# Altium project Adapter_NI_IP_L0.PrjPCB
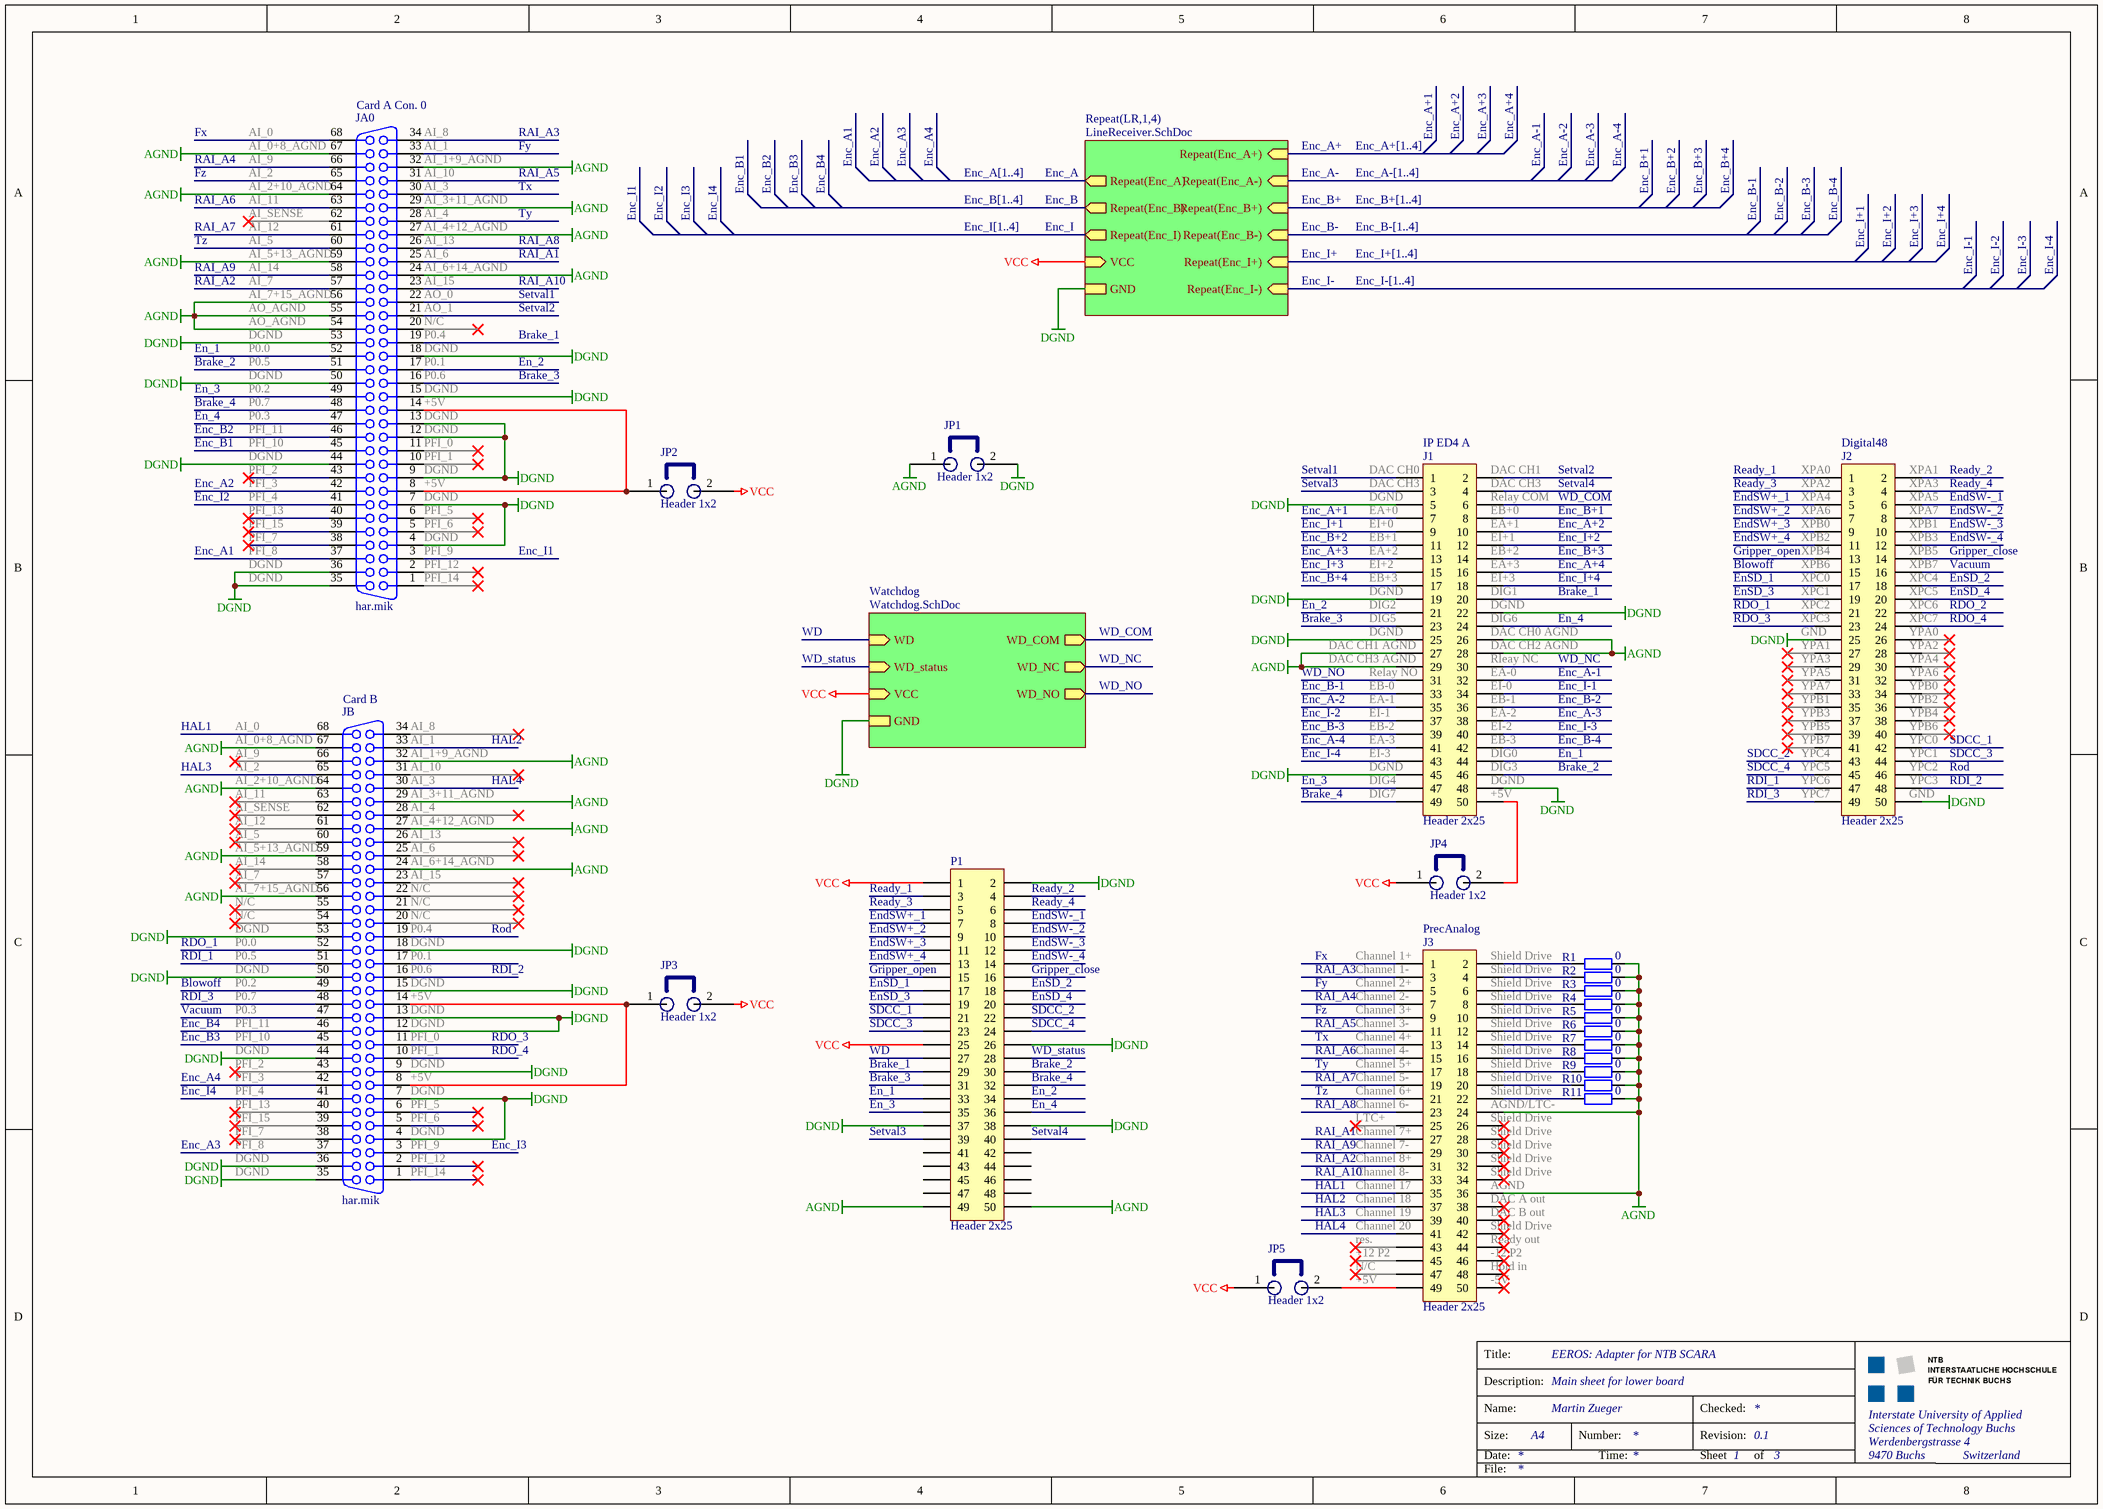
[diagram p0: Schematic_L0.SchDoc]
3 sheets, 80 parts. Net scope: hierarchical (ports join the sheet entries above them; power ports are global).
Board file: PCB_L0.PcbDoc
Sheets:
  Schematic_L0.SchDoc
    LR1 = LineReceiver.SchDoc
    LR2 = LineReceiver.SchDoc
    LR3 = LineReceiver.SchDoc
    LR4 = LineReceiver.SchDoc
    Watchdog = Watchdog.SchDoc

## Sheet Schematic_L0.SchDoc: EEROS: Adapter for NTB SCARA
size A3; Author: Martin Zueger; CompanyName: Company Name; Organization: Interstate University of Applied; Address1: Werdenbergstrasse 4; Address3: 9470 Buchs; Address4: Switzerland; Revision: 0.1; SheetNumber: 1; SheetTotal: 3; Organization1: Sciences of Technology Buchs; Description: Main sheet for lower board; ProjectName: EEROS

### Parts
J1  Header 2x25  [Header - 2x25 - Boxed]
J2  Header 2x25  [Header - 2x25 - Boxed]
J3  Header 2x25  [Header - 2x25 - Boxed]
JA0  har.mik  [HAR-MIK P/S 68 SA]
JB  har.mik  [HAR-MIK P/S 68 SA]
JP1  Header 1x2  [Header - 1x2 - V]
JP2  Header 1x2  [Header - 1x2 - V]
JP3  Header 1x2  [Header - 1x2 - V]
JP4  Header 1x2  [Header - 1x2 - V]
JP5  Header 1x2  [Header - 1x2 - V]
P1  Header 2x25  [Header - 2x25 - V]
R1  0  [0805]
R2  0  [0805]
R3  0  [0805]
R4  0  [0805]
R5  0  [0805]
R6  0  [0805]
R7  0  [0805]
R8  0  [0805]
R9  0  [0805]
R10  0  [0805]
R11  0  [0805]

### Sub-sheets
Repeat(LR,1,4) = LineReceiver.SchDoc: Repeat(Enc_A), Repeat(Enc_B), Repeat(Enc_I), Repeat(Enc_A+) (in), Repeat(Enc_B+), Repeat(Enc_B-), Repeat(Enc_I+), Repeat(Enc_I-), Repeat(Enc_A-), VCC, GND
Watchdog = Watchdog.SchDoc: WD_COM, WD_NC, WD_NO, WD, VCC, GND, WD_status

### Nets
AGND: J1.26 J1.27 J1.28 J1.29 J3.24 J3.36 JA0.24 JA0.27 JA0.29 JA0.32 JA0.54 JA0.55 JA0.56 JA0.59 JA0.64 JA0.67 JB.24 JB.27 JB.29 JB.32 JB.56 JB.59 JB.64 JB.67 JP1.1 P1.49 P1.50 R1.2 R2.2 R3.2 R4.2 R5.2 R6.2 R7.2 R8.2 R9.2 R10.2 R11.2
DGND: J1.5 J1.19 J1.22 J1.25 J1.45 J1.48 J2.25 J2.50 JA0.4 JA0.7 JA0.9 JA0.12 JA0.13 JA0.15 JA0.18 JA0.35 JA0.36 JA0.44 JA0.50 JA0.53 JB.4 JB.7 JB.9 JB.12 JB.13 JB.15 JB.18 JB.35 JB.36 JB.44 JB.50 JB.53 JP1.2 P1.2 P1.26 P1.37 P1.38 ; sheet Repeat(LR,1,4)/GND, sheet Watchdog/GND
VCC: JP2.2 JP3.2 JP4.1 JP5.1 P1.1 P1.25 ; sheet Repeat(LR,1,4)/VCC, sheet Watchdog/VCC
Blowoff: J2.15 JB.49
Brake_1: J1.20 JA0.19 P1.29
Brake_2: J1.46 JA0.51 P1.30
Brake_3: J1.23 JA0.16 P1.31
Brake_4: J1.49 JA0.48 P1.32
En_1: J1.44 JA0.52 P1.33
En_2: J1.21 JA0.17 P1.34
En_3: J1.47 JA0.49 P1.35
En_4: J1.24 JA0.47 P1.36
Enc_A: sheet Repeat(LR,1,4)/Repeat(Enc_A)
Enc_A1: JA0.37
Enc_A2: JA0.42
Enc_A3: JB.37
Enc_A4: JB.42
Enc_A+: sheet Repeat(LR,1,4)/Repeat(Enc_A+)
Enc_A+1: J1.7
Enc_A+2: J1.10
Enc_A+3: J1.13
Enc_A+4: J1.16
Enc_A-: sheet Repeat(LR,1,4)/Repeat(Enc_A-)
Enc_A-1: J1.32
Enc_A-2: J1.35
Enc_A-3: J1.38
Enc_A-4: J1.41
Enc_B: sheet Repeat(LR,1,4)/Repeat(Enc_B)
Enc_B1: JA0.45
Enc_B2: JA0.46
Enc_B3: JB.45
Enc_B4: JB.46
Enc_B+: sheet Repeat(LR,1,4)/Repeat(Enc_B+)
Enc_B+1: J1.8
Enc_B+2: J1.11
Enc_B+3: J1.14
Enc_B+4: J1.17
Enc_B-: sheet Repeat(LR,1,4)/Repeat(Enc_B-)
Enc_B-1: J1.33
Enc_B-2: J1.36
Enc_B-3: J1.39
Enc_B-4: J1.42
Enc_I: sheet Repeat(LR,1,4)/Repeat(Enc_I)
Enc_I1: JA0.3
Enc_I2: JA0.41
Enc_I3: JB.3
Enc_I4: JB.41
Enc_I+: sheet Repeat(LR,1,4)/Repeat(Enc_I+)
Enc_I+1: J1.9
Enc_I+2: J1.12
Enc_I+3: J1.15
Enc_I+4: J1.18
Enc_I-: sheet Repeat(LR,1,4)/Repeat(Enc_I-)
Enc_I-1: J1.34
Enc_I-2: J1.37
Enc_I-3: J1.40
Enc_I-4: J1.43
EndSW+_1: J2.5 P1.7
EndSW+_2: J2.7 P1.9
EndSW+_3: J2.9 P1.11
EndSW+_4: J2.11 P1.13
EndSW-_1: J2.6 P1.8
EndSW-_2: J2.8 P1.10
EndSW-_3: J2.10 P1.12
EndSW-_4: J2.12 P1.14
EnSD_1: J2.17 P1.17
EnSD_2: J2.18 P1.18
EnSD_3: J2.19 P1.19
EnSD_4: J2.20 P1.20
Fx: J3.1 JA0.68
Fy: J3.5 JA0.33
Fz: J3.9 JA0.65
Gripper_close: J2.14 P1.16
Gripper_open: J2.13 P1.15
HAL1: J3.35 JB.68
HAL2: J3.37 JB.33
HAL3: J3.39 JB.65
HAL4: J3.41 JB.30
RAI_A1: J3.27 JA0.25
RAI_A2: J3.31 JA0.57
RAI_A3: J3.3 JA0.34
RAI_A4: J3.7 JA0.66
RAI_A5: J3.11 JA0.31
RAI_A6: J3.15 JA0.63
RAI_A7: J3.19 JA0.61
RAI_A8: J3.23 JA0.26
RAI_A9: J3.29 JA0.58
RAI_A10: J3.33 JA0.23
RDI_1: J2.47 JB.51
RDI_2: J2.48 JB.16
RDI_3: J2.49 JB.48
RDO_1: J2.21 JB.52
RDO_2: J2.22
RDO_3: J2.23 JB.11
RDO_4: J2.24 JB.10
Ready_1: J2.1 P1.3
Ready_2: J2.2 P1.4
Ready_3: J2.3 P1.5
Ready_4: J2.4 P1.6
Rod: J2.46 JB.19
SDCC_1: J2.42 P1.21
SDCC_2: J2.43 P1.22
SDCC_3: J2.44 P1.23
SDCC_4: J2.45 P1.24
Setval1: J1.1 JA0.22
Setval2: J1.2 JA0.21
Setval3: J1.3 P1.39
Setval4: J1.4 P1.40
Tx: J3.13 JA0.30
Ty: J3.17 JA0.28
Tz: J3.21 JA0.60
Vacuum: J2.16 JB.47
WD: P1.27 ; sheet Watchdog/WD
WD_COM: J1.6 ; sheet Watchdog/WD_COM
WD_NC: J1.30 ; sheet Watchdog/WD_NC
WD_NO: J1.31 ; sheet Watchdog/WD_NO
WD_status: P1.28 ; sheet Watchdog/WD_status
NetJ1_50: J1.50 JP4.2
NetJ3_2: J3.2 R1.1
NetJ3_4: J3.4 R2.1
NetJ3_6: J3.6 R3.1
NetJ3_8: J3.8 R4.1
NetJ3_10: J3.10 R5.1
NetJ3_12: J3.12 R6.1
NetJ3_14: J3.14 R7.1
NetJ3_16: J3.16 R8.1
NetJ3_18: J3.18 R9.1
NetJ3_20: J3.20 R10.1
NetJ3_22: J3.22 R11.1
NetJ3_49: J3.49 JP5.2
NetJA0_8: JA0.8 JA0.14 JP2.1
NetJB_8: JB.8 JB.14 JP3.1

Not connected (* = marked no-connect by the designer): J2 26* 27* 28* 29* 30* 31* 32* 33* 34* 35* 36* 37* 38* 39* 40* 41*; J3 25* 26* 28* 30* 32* 34* 38* 40* 42* 43* 44* 45* 46* 47* 48* 50*; JA0 1* 2* 5* 6* 10* 11* 20* 38* 39* 40* 43* 62*; JB 1* 2* 5* 6* 17 20* 21* 22* 23* 25* 26* 28* 31* 34* 38* 39* 40* 43* 54* 55* 57* 58* 60* 61* 62* 63* 66*; P1 41 42 43 44 45 46 47 48

### Buses and harness runs
bus Enc_A+[1..4]
bus Enc_A-[1..4]
bus Enc_A[1..4]
bus Enc_B+[1..4]
bus Enc_B-[1..4]
bus Enc_B[1..4]
bus Enc_I+[1..4]
bus Enc_I-[1..4]
bus Enc_I[1..4]

### Notes on the sheet
- (near JA0) Card A Con. 0
- AI_0
- AI_9
- AI_2
- (near JA0) AI_0+8_AGND
- (near JA0) AI_8
- (near JA0) AI_1
- (near JA0) AI_1+9_AGND
- (near JA0) AI_10
- AI_11
- AI_SENSE
- AI_12
- AI_5
- (near JA0) AI_2+10_AGND
- (near JA0) AI_3
- (near JA0) AI_3+11_AGND
- (near JA0) AI_4
- (near JA0) AI_4+12_AGND
- (near JA0) AI_13
- AI_14
- AI_7
- AO_AGND
- (near JA0) AI_7+15_AGND
- (near JA0) AI_5+13_AGND
- (near JA0) AI_6
- (near JA0) AI_6+14_AGND
- (near JA0) AI_15
- (near JA0) AO_0
- (near JA0) AO_1
- P0.0
- P0.5
- DGND
- (near JA0) N/C
- (near JA0) P0.4
- (near JA0) DGND
- (near JA0) P0.1
- (near JA0) P0.6
- P0.2
- P0.7
- P0.3
- PFI_11
- PFI_10
- (near JA0) +5V
- (near JA0) PFI_0
- (near J1) IP ED4 A
- (near J2) Digital48
- PFI_2
- PFI_3
- PFI_4
- PFI_13
- (near JA0) PFI_1
- (near JA0) PFI_5
- (near J1) DAC CH0
- (near J1) DAC CH3
- (near J1) DGND
- (near J1) EA+0
- (near J1) DAC CH1
- (near J1) Relay COM
- (near J1) EB+0
- (near J2) XPA0
- (near J2) XPA2
- (near J2) XPA4
- (near J2) XPA6
- (near J2) XPA1
- (near J2) XPA3
- (near J2) XPA5
- (near J2) XPA7
- PFI_15
- PFI_7
- PFI_8
- (near JA0) PFI_6
- (near JA0) PFI_9
- (near JA0) PFI_12
- (near JA0) PFI_14
- (near J1) EB+3
- (near J1) EI+2
- (near J1) EA+2
- (near J1) EB+1
- (near J1) EI+0
- (near J1) EA+1
- (near J1) EI+1
- (near J1) EB+2
- (near J1) EA+3
- (near J1) EI+3
- (near J2) XPB0
- (near J2) XPB2
- (near J2) XPB4
- (near J2) XPB6
- (near J2) XPC0
- (near J2) XPB1
- (near J2) XPB3
- (near J2) XPB5
- (near J2) XPB7
- (near J2) XPC4
- (near J1) DAC CH1 AGND
- (near J1) DIG5
- (near J1) DIG2
- (near J1) DAC CH0 AGND
- (near J1) DAC CH2 AGND
- (near J1) DIG1
- (near J1) DIG6
- (near J2) XPC1
- (near J2) XPC2
- (near J2) XPC3
- (near J2) GND
- (near J2) YPA1
- (near J2) XPC5
- (near J2) XPC6
- (near J2) XPC7
- (near J2) YPA0
- (near J2) YPA2
- (near JB) Card B
- (near J1) DAC CH3 AGND
- (near J1) Relay NO
- (near J1) EI-1
- (near J1) EA-1
- (near J1) EB-0
- (near J1) Rleay NC
- (near J1) EA-0
- (near J1) EI-0
- (near J1) EB-1
- (near J1) EA-2
- (near J2) YPA3
- (near J2) YPA5
- (near J2) YPA7
- (near J2) YPB1
- (near J2) YPB3
- (near J2) YPA4
- (near J2) YPA6
- (near J2) YPB0
- (near J2) YPB2
- (near J2) YPB4
- (near JB) AI_2+10_AGND
- (near JB) AI_0+8_AGND
- (near JB) AI_8
- (near JB) AI_1
- (near JB) AI_1+9_AGND
- (near JB) AI_10
- (near JB) AI_3
- (near J1) DIG4
- (near J1) EI-3
- (near J1) EA-3
- (near J1) EB-2
- (near J1) EI-2
- (near J1) EB-3
- (near J1) DIG0
- (near J1) DIG3
- (near J2) YPB5
- (near J2) YPB7
- (near J2) YPC4
- (near J2) YPC5
- (near J2) YPC6
- (near J2) YPB6
- (near J2) YPC0
- (near J2) YPC1
- (near J2) YPC2
- (near J2) YPC3
- (near JB) AI_5+13_AGND
- (near JB) AI_3+11_AGND
- (near JB) AI_4
- (near JB) AI_4+12_AGND
- (near JB) AI_13
- (near JB) AI_6
- (near J1) DIG7
- (near J1) +5V
- (near J2) YPC7
- (near JB) AI_7+15_AGND
- N/C
- (near JB) N/C
- (near JB) AI_6+14_AGND
- (near JB) AI_15
- (near JB) P0.4
- (near JB) DGND
- (near JB) P0.1
- (near JB) P0.6
- (near J3) Channel 1+
- (near J3) Channel 1-
- (near J3) Channel 2+
- PrecAnalog
- Shield Drive
- (near JB) +5V
- (near JB) PFI_0
- (near JB) PFI_1
- (near J3) Channel 2-
- (near J3) Channel 3+
- (near J3) Channel 3-
- (near J3) Channel 4+
- (near J3) Channel 4-
- (near JB) PFI_5
- (near JB) PFI_6
- (near J3) Channel 5+
- (near J3) Channel 5-
- (near J3) Channel 6+
- (near J3) Channel 6-
- (near J3) LTC+
- (near J3) AGND/LTC-
- (near J3) Shield Drive
- (near JB) PFI_9
- (near JB) PFI_12
- (near JB) PFI_14
- (near J3) Channel 7+
- (near J3) Channel 7-
- (near J3) Channel 8+
- (near J3) Channel 8-
- (near J3) Channel 17
- (near J3) AGND
- (near J3) Channel 18
- (near J3) Channel 19
- (near J3) Channel 20
- res.
- (near J3) +12 P2
- (near J3) DAC A out
- (near J3) DAC B out
- (near J3) Ready out
- (near J3) -12 P2
- +5V
- (near J3) Hold in
- (near J3) -5V
- Title:
- Description:
- Size:
- Date:
- Name:
- A4
- Number:
- Time:
- Revision:
- Sheet
- Checked:
- of
- File:

### Library data of the parts
J1-J3 P1 = Header 2x25: Header, 25-Pin, Dual row; LatestRevisionDate: 17-Jul-2002; LatestRevisionNote: Re-released for DXP Platform.; Publisher: Altium Limited
JA0 JB = Connector 68: TB 60 01 068 5232; PackageDocument: B; Positions: 68; Published: 15-Jun-2001; LatestRevisionDate: 17-Jul-2002; LatestRevisionNote: Re-released for DXP Platform.; DatasheetDocument: 1-Oct-1983; PackageReference: 178240-8; Publisher: Altium Limited; Orientation: Right Angle
JP1-JP5 = Jumper
R1-R11 = R: Resistor; #Manufacturer: Generic Components; #Publisher: Dr. A. Heinzelmann; #Class: Passive; #Published: 2006-10-06; #ClassSub: Resistor; Value: 0

## Sheet LineReceiver.SchDoc: EEROS: Adapter for NTB SCARA
size A4; Author: URSS; CompanyName: NTB; DrawnBy: Martin Zueger; Organization: NTB Interstate University of Applied; Address1: Werdenbergstrasse 4; Address3: 9471 Buchs; Address4: Switzerland; Revision: 0.1; SheetNumber: 2; SheetTotal: 3; Organization1: Sciences of Technology Buchs; Description: Line Receiver A,B and I with SN75175D; ProjectName: EEROS
Used 4 times, as channels LR1, LR2, LR3, LR4. Parts and nets are listed once, with the designators drawn on the sheet.
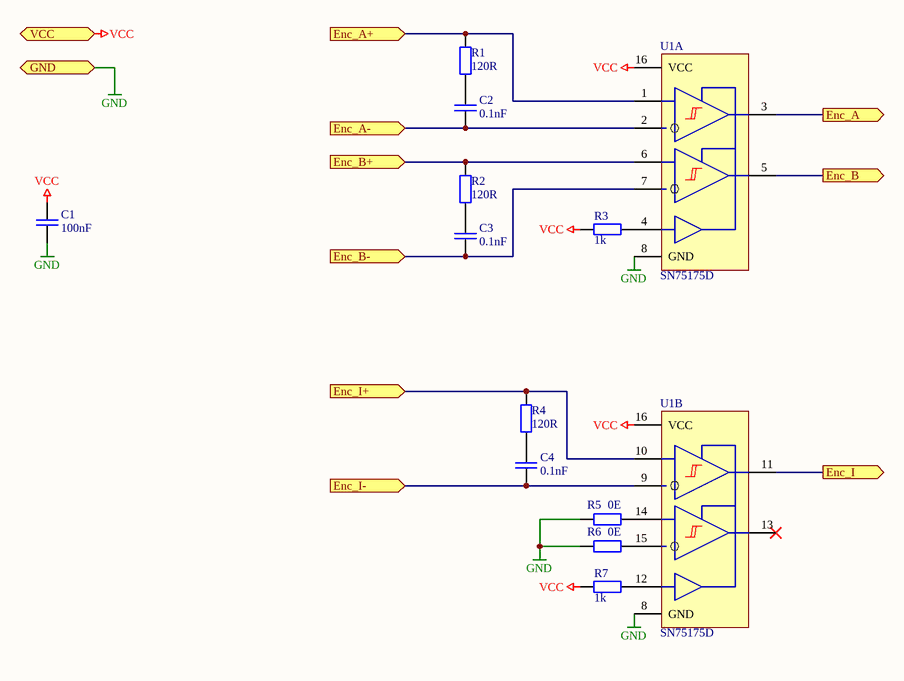
[diagram p1: LineReceiver.SchDoc]

### Parts
C1  100nF  [1206]
C2  0.1nF  [0805]
C3  0.1nF  [0805]
C4  0.1nF  [0805]
R1  120R  [0805]
R2  120R  [0805]
R3  1k  [0805]
R4  120R  [0805]
R5  0E  [0805]
R6  0E  [0805]
R7  1k  [0805]
U1  SN75175D  [SO16-M]  (parts A,B of 2)

### Ports
Enc_A (out), Enc_A+ (in), Enc_A- (in), Enc_B (out), Enc_B+ (in), Enc_B- (in), Enc_I (out), Enc_I+ (in), Enc_I- (in), GND, VCC (in)

### Nets
GND: C1.1 R5.2 R6.2 U1.8(GND) ; port GND
VCC: C1.2 R3.2 R7.2 U1.16(VCC) ; port VCC
Enc_A: U1.3 ; port Enc_A
Enc_A+: R1.2 U1.1 ; port Enc_A+
Enc_A-: C2.1 U1.2 ; port Enc_A-
Enc_B: U1.5 ; port Enc_B
Enc_B+: R2.2 U1.6 ; port Enc_B+
Enc_B-: C3.1 U1.7 ; port Enc_B-
Enc_I: U1.11 ; port Enc_I
Enc_I+: R4.2 U1.10 ; port Enc_I+
Enc_I-: C4.1 U1.9 ; port Enc_I-
NetC2_2: C2.2 R1.1
NetC3_2: C3.2 R2.1
NetC4_2: C4.2 R4.1
NetR3_1: R3.1 U1.4(EN)
NetR5_1: R5.1 U1.14
NetR6_1: R6.1 U1.15
NetR7_1: R7.1 U1.12

Not connected (* = marked no-connect by the designer): U1 13*

### Channels
LR1: designators end in _LR1; ports Enc_A+=Enc_A+1 Enc_A-=Enc_A-1 Enc_A=Enc_A1 Enc_B+=Enc_B+1 Enc_B-=Enc_B-1 Enc_B=Enc_B1 Enc_I+=Enc_I+1 Enc_I-=Enc_I-1 Enc_I=Enc_I1 GND=DGND VCC=VCC
LR2: designators end in _LR2; ports Enc_A+=Enc_A+2 Enc_A-=Enc_A-2 Enc_A=Enc_A2 Enc_B+=Enc_B+2 Enc_B-=Enc_B-2 Enc_B=Enc_B2 Enc_I+=Enc_I+2 Enc_I-=Enc_I-2 Enc_I=Enc_I2 GND=DGND VCC=VCC
LR3: designators end in _LR3; ports Enc_A+=Enc_A+3 Enc_A-=Enc_A-3 Enc_A=Enc_A3 Enc_B+=Enc_B+3 Enc_B-=Enc_B-3 Enc_B=Enc_B3 Enc_I+=Enc_I+3 Enc_I-=Enc_I-3 Enc_I=Enc_I3 GND=DGND VCC=VCC
LR4: designators end in _LR4; ports Enc_A+=Enc_A+4 Enc_A-=Enc_A-4 Enc_A=Enc_A4 Enc_B+=Enc_B+4 Enc_B-=Enc_B-4 Enc_B=Enc_B4 Enc_I+=Enc_I+4 Enc_I-=Enc_I-4 Enc_I=Enc_I4 GND=DGND VCC=VCC

### Notes on the sheet
- Title:
- Description:
- Size:
- Date:
- Name:
- A4
- Number:
- Time:
- Revision:
- Sheet
- Checked:
- of
- File:

### Library data of the parts
C1-C4 = C: Capacitor; #Manufacturer: Generic Components; #Publisher: Dr. A. Heinzelmann; #Class: Passive; Initial Voltage: 0V; Voltage Maximum: ??? V; #Published: 2006-10-07; #ClassSub: Capacitor
  C1: Value: 100nF
  C2-C4: Value: 0.1nF
R1-R7 = R: as R1 on sheet Schematic_L0; #Published: 2006-10-06; #ClassSub: Resistor
  R1 R2 R4: Value: 120R
  R3 R7: Value: 1k
  R5 R6: Value: 0E
U1 = SN75175D: TEXAS INSTRUMENTS - SN75175D - LINE RECEIVER,QUAD RS485/422/423; #Manufacturer: TI; #Class: Interface; OrderNr: 1103177; Published: 20121204; LatestRevisionDate: 20121204; LatestRevisionNote: create symbol and footprint; PackageReference: TI--R-PDSO-G16--SOIC16; Publisher: Stefan Ursella, M.Eng; #ClassSub: line receiver; ComponentLink1Description: Distributor; ComponentLink1URL: http://ch.farnell.com/texas-instruments/sn75175d/line-receiver-quad-rs485-422-423/dp/1103177; Distributor: Farnell; PackageDescription: SOIC16; Type: SN75175D

## Sheet Watchdog.SchDoc: EEROS: Adapter for NTB SCARA
size A4; DrawnBy: Martin Zueger; Organization: Interstate University of Applied; Address1: Werdenbergstrasse 4; Address3: 9470 Buchs; Address4: Switzerland; Revision: 0.1; SheetNumber: 3; SheetTotal: 3; Organization1: Sciences of Technology Buchs; ProjectName: EEROS
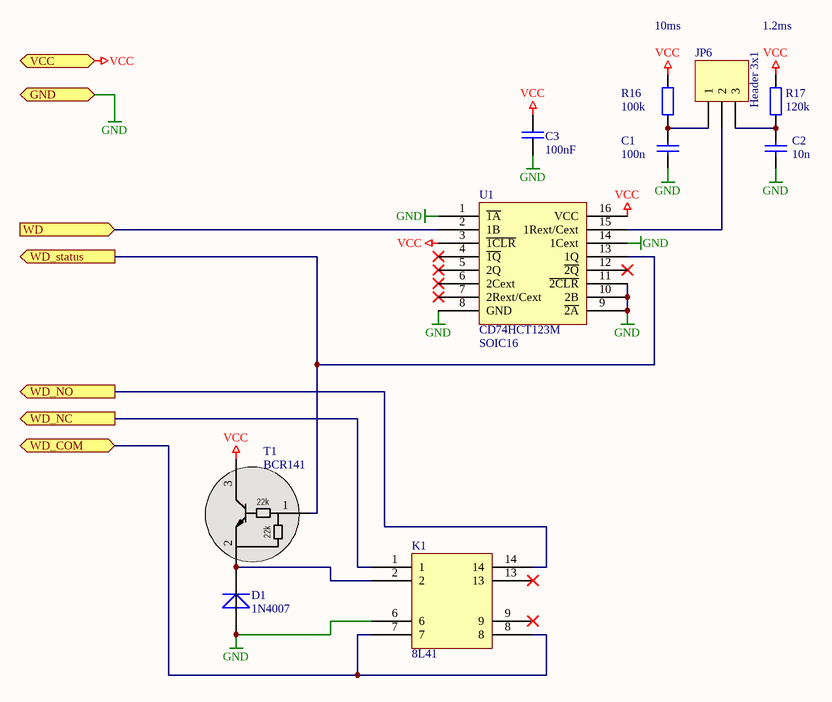
[diagram p2: Watchdog.SchDoc]

### Parts
C1  100n  [0805]
C2  10n  [0805]
C3  100nF  [1206]
D1  1N4007  [SMD-DO214AC]
JP6  Header 3x1  [Header - 1x3 - V]
K1  8L41  [8L41]
R16  100k  [0805]
R17  120k  [0805]
T1  BCR141  [SOT23-3Pin]
U1  Footprint: SOIC16  [SO16-W]  (hidden comment: CD74HCT123M)

### Ports
GND, VCC (in), WD (in), WD_COM, WD_NC (out), WD_NO (out), WD_status (out)

### Nets
GND: C1.1 C2.1 C3.1 D1.2(A) K1.6 U1.1(~{1A}) U1.8(GND) U1.9(~{2A}) U1.10(2B) U1.11(~{2CLR}) U1.14(1Cext) ; port GND  [project net DGND]
VCC: C3.2 R16.2 R17.2 T1.3(C) U1.3(~{1CLR}) U1.16(VCC) ; port VCC
WD: U1.2(1B) ; port WD
WD_COM: K1.7 K1.8 ; port WD_COM
WD_NC: K1.1 ; port WD_NC
WD_NO: K1.14 ; port WD_NO
WD_status: T1.1(B) U1.13(1Q) ; port WD_status
NetC1_2: C1.2 JP6.1 R16.1
NetC2_2: C2.2 JP6.3 R17.1
NetD1_1: D1.1(K) K1.2 T1.2(E)
NetJP6_2: JP6.2 U1.15(1Rext/Cext)

Not connected (* = marked no-connect by the designer): K1 9* 13*; U1 4(~{1Q})* 5(2Q)* 6(2Cext)* 7(2Rext/Cext)* 12(~{2Q})*

### Notes on the sheet
- 10ms
- 1.2ms
- Title:
- Description:
- Size:
- Date:
- Name:
- A4
- Number:
- Time:
- Revision:
- Sheet
- Checked:
- of
- File:
- (in symbol BCR141) 22k

### Library data of the parts
C1 C2 = C: Capacitor; #Manufacturer: Generic Components; #Publisher: Dr. A. Heinzelmann; #Class: Passive; Initial Voltage: 0V; #Published: 2006-10-07; #ClassSub: Capacitor; Voltage Maximum: *
  C1: Value: 100n
  C2: Value: 10n
C3 = C: as C1 on sheet LineReceiver; #Published: 2006-10-07; #ClassSub: Capacitor; Value: 100nF
D1 = 1N4148: High Conductance Fast Diode; #Manufacturer: Generic Components; #Publisher: Dr. A. Heinzelmann; #Class: Discrete; #ClassSub: Diode - Switching; #Published: 2006-10-31; ComponentLink1Description: Datasheet; ComponentLink1URL: https://www.distrelec.com/distrelec/datasheets.nsf/WebAttachments/13CA773B80E18E83C125722E0045A8DA/$File/Diotec_Silizium-Dioden_bedrahtet_1N_4148_-_1N_4448_-_1N_4150..._Datasheet_DE_EN.pdf; ComponentLink2Description: Distributor; ComponentLink2URL: https://www.distrelec.ch/ishopWebFront/catalog/product.do/para/node/is/acaaaaaaaaaa/and/highlightNode/is/603016/and/id/is/01/and/series/is/1.html; Value: 1N4007
JP6 = Header 3: Header, 3-Pin; LatestRevisionDate: 17-Jul-2002; LatestRevisionNote: Re-released for DXP Platform.; Publisher: Altium Limited
K1 = 8L41: Reed Relais
R16 R17 = R: as R1 on sheet Schematic_L0; #Published: 2006-10-06; #ClassSub: Resistor
  R16: Value: 100k
  R17: Value: 120k
T1 = BCR141: General Purpose NPN Transistor; Manufacturer: Infineon; Type: BCR141; Footprint: ???
U1 = CD74HCT123M: Multivibrator; Type: CD74HCT123M

## Nets that join several sheets
DGND: Schematic_L0 (37 pins), LR1 (C1_LR1.1 R5_LR1.2 R6_LR1.2 U1_LR1.8), LR2 (C1_LR2.1 R5_LR2.2 R6_LR2.2 U1_LR2.8), LR3 (C1_LR3.1 R5_LR3.2 R6_LR3.2 U1_LR3.8), LR4 (C1_LR4.1 R5_LR4.2 R6_LR4.2 U1_LR4.8), Watchdog (11 pins)
VCC: Schematic_L0 (6 pins), LR1 (C1_LR1.2 R3_LR1.2 R7_LR1.2 U1_LR1.16), LR2 (C1_LR2.2 R3_LR2.2 R7_LR2.2 U1_LR2.16), LR3 (C1_LR3.2 R3_LR3.2 R7_LR3.2 U1_LR3.16), LR4 (C1_LR4.2 R3_LR4.2 R7_LR4.2 U1_LR4.16), Watchdog (6 pins)
Enc_A1: Schematic_L0 (JA0.37), LR1 (U1_LR1.3)
Enc_A2: Schematic_L0 (JA0.42), LR2 (U1_LR2.3)
Enc_A3: Schematic_L0 (JB.37), LR3 (U1_LR3.3)
Enc_A4: Schematic_L0 (JB.42), LR4 (U1_LR4.3)
Enc_A+1: Schematic_L0 (J1.7), LR1 (R1_LR1.2 U1_LR1.1)
Enc_A+2: Schematic_L0 (J1.10), LR2 (R1_LR2.2 U1_LR2.1)
Enc_A+3: Schematic_L0 (J1.13), LR3 (R1_LR3.2 U1_LR3.1)
Enc_A+4: Schematic_L0 (J1.16), LR4 (R1_LR4.2 U1_LR4.1)
Enc_A-1: Schematic_L0 (J1.32), LR1 (C2_LR1.1 U1_LR1.2)
Enc_A-2: Schematic_L0 (J1.35), LR2 (C2_LR2.1 U1_LR2.2)
Enc_A-3: Schematic_L0 (J1.38), LR3 (C2_LR3.1 U1_LR3.2)
Enc_A-4: Schematic_L0 (J1.41), LR4 (C2_LR4.1 U1_LR4.2)
Enc_B1: Schematic_L0 (JA0.45), LR1 (U1_LR1.5)
Enc_B2: Schematic_L0 (JA0.46), LR2 (U1_LR2.5)
Enc_B3: Schematic_L0 (JB.45), LR3 (U1_LR3.5)
Enc_B4: Schematic_L0 (JB.46), LR4 (U1_LR4.5)
Enc_B+1: Schematic_L0 (J1.8), LR1 (R2_LR1.2 U1_LR1.6)
Enc_B+2: Schematic_L0 (J1.11), LR2 (R2_LR2.2 U1_LR2.6)
Enc_B+3: Schematic_L0 (J1.14), LR3 (R2_LR3.2 U1_LR3.6)
Enc_B+4: Schematic_L0 (J1.17), LR4 (R2_LR4.2 U1_LR4.6)
Enc_B-1: Schematic_L0 (J1.33), LR1 (C3_LR1.1 U1_LR1.7)
Enc_B-2: Schematic_L0 (J1.36), LR2 (C3_LR2.1 U1_LR2.7)
Enc_B-3: Schematic_L0 (J1.39), LR3 (C3_LR3.1 U1_LR3.7)
Enc_B-4: Schematic_L0 (J1.42), LR4 (C3_LR4.1 U1_LR4.7)
Enc_I1: Schematic_L0 (JA0.3), LR1 (U1_LR1.11)
Enc_I2: Schematic_L0 (JA0.41), LR2 (U1_LR2.11)
Enc_I3: Schematic_L0 (JB.3), LR3 (U1_LR3.11)
Enc_I4: Schematic_L0 (JB.41), LR4 (U1_LR4.11)
Enc_I+1: Schematic_L0 (J1.9), LR1 (R4_LR1.2 U1_LR1.10)
Enc_I+2: Schematic_L0 (J1.12), LR2 (R4_LR2.2 U1_LR2.10)
Enc_I+3: Schematic_L0 (J1.15), LR3 (R4_LR3.2 U1_LR3.10)
Enc_I+4: Schematic_L0 (J1.18), LR4 (R4_LR4.2 U1_LR4.10)
Enc_I-1: Schematic_L0 (J1.34), LR1 (C4_LR1.1 U1_LR1.9)
Enc_I-2: Schematic_L0 (J1.37), LR2 (C4_LR2.1 U1_LR2.9)
Enc_I-3: Schematic_L0 (J1.40), LR3 (C4_LR3.1 U1_LR3.9)
Enc_I-4: Schematic_L0 (J1.43), LR4 (C4_LR4.1 U1_LR4.9)
WD: Schematic_L0 (P1.27), Watchdog (U1.2)
WD_COM: Schematic_L0 (J1.6), Watchdog (K1.7 K1.8)
WD_NC: Schematic_L0 (J1.30), Watchdog (K1.1)
WD_NO: Schematic_L0 (J1.31), Watchdog (K1.14)
WD_status: Schematic_L0 (P1.28), Watchdog (T1.1 U1.13)